# EAGLE design Valve_master (EAGLE 8.2.2)
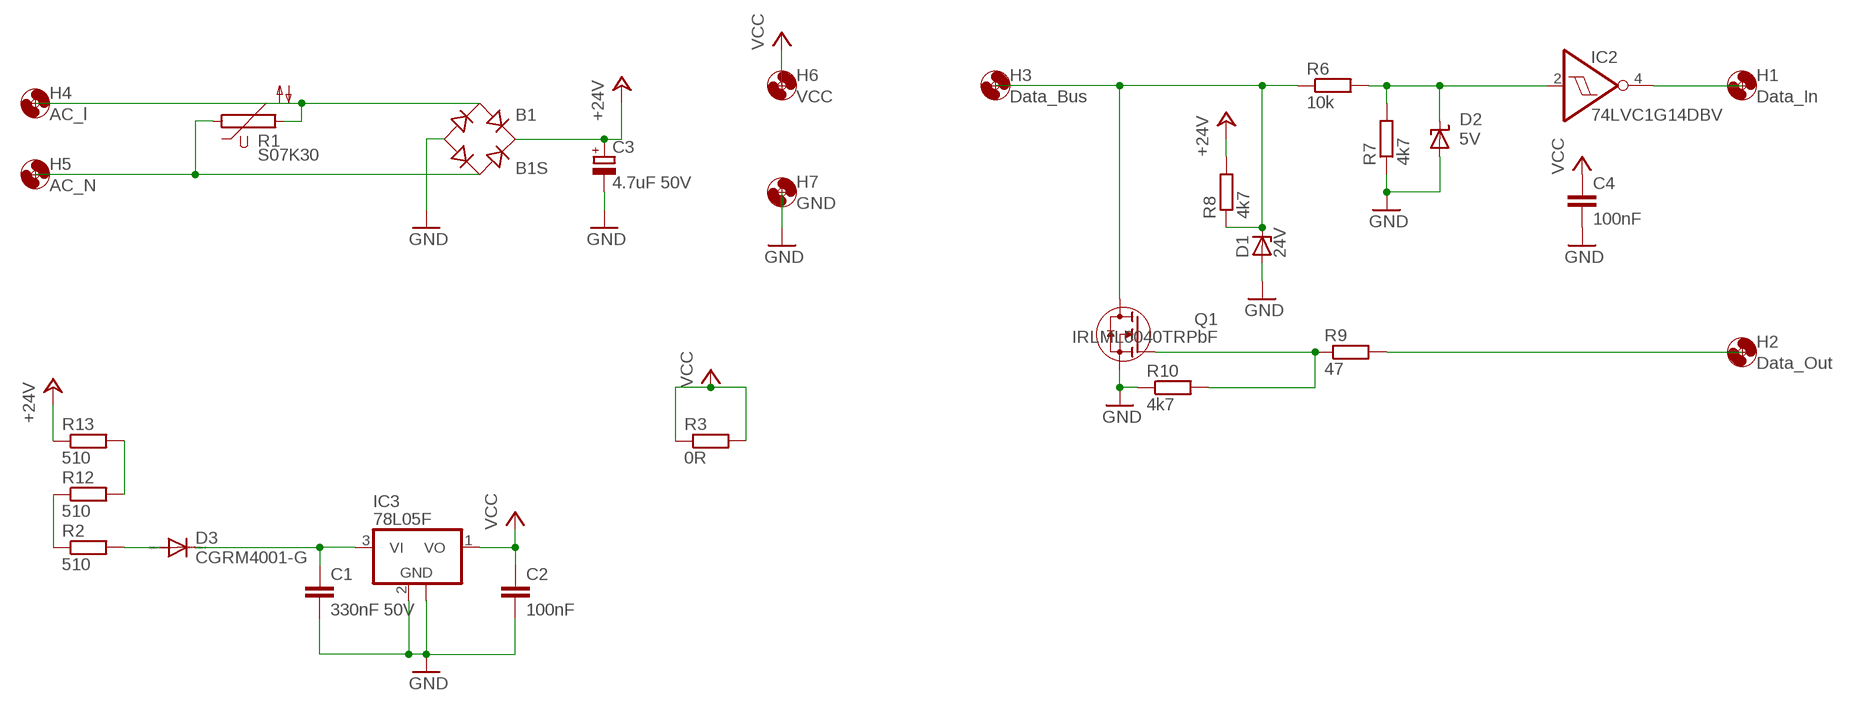
[diagram p0: schematic, sheet 1]

## Parts
B1  B1S  [MBS]
C1  330nF 50V  C-EUC0805K  [C0805K]
C2  100nF  C-EUC0805K  [C0805K]
C3  4.7uF 50V  CPOL-EUD/7343-31R  [D/7343-31R]
C4  100nF  C0805  [0805]
D1  24V  ZENER-DIODESOT23  [SOT23]
D2  5V  ZENER  [SOD123]
D3  CGRM4001-G  [SOD-123_MINI-SMA]
H1  Data_In  MOUNT-HOLE3.2  [3,2]
H2  Data_Out  MOUNT-HOLE3.2  [3,2]
H3  Data_Bus  MOUNT-HOLE3.2  [3,2]
H4  AC_l  MOUNT-HOLE3.2  [3,2]
H5  AC_N  MOUNT-HOLE3.2  [3,2]
H6  VCC  MOUNT-HOLE3.2  [3,2]
H7  GND  MOUNT-HOLE3.2  [3,2]
IC2  74LVC1G14DBV  [SOT23-5]
IC3  78L05F  [SOT89]
Q1  IRLML0040TRPbF  SI2302  [SOT-23-GSD]
R1  S07K30  S07K40  [S07K40]
R2  510  R-EU_R2512  [R2512]
R3  0R  R0805  [0805R]
R6  10k  R-EU_R0805  [R0805]
R7  4k7  R-EU_R0805  [R0805]
R8  4k7  R-EU_R0805  [R0805]
R9  47  R-EU_R0805  [R0805]
R10  4k7  R-EU_R0805  [R0805]
R12  510  R-EU_R2512  [R2512]
R13  510  R-EU_R2512  [R2512]

## Nets
+24V: B1.+ C3.+ R8.2 R13.1
AC_L: B1.AC1 H4.P$1 R1.2
AC_N: B1.AC2 H5.P$1 R1.1
DATA_BUS: D1.3(C) H3.P$1 Q1.D R6.1 R8.1
DATA_IN: H1.P$1 IC2.4(O)
DATA_OUT: H2.P$1 R9.2
GND: B1.- C1.2 C2.2 C3.- C4.2 D1.1(A) D2.A H7.P$1 IC3.2(GND) IC3.2@1(GND) Q1.S R7.1 R10.1
N$1: C1.1 D3.C IC3.3(VI)
N$2: D3.A R2.2
N$3: R12.2 R13.2
N$5: R2.1 R12.1
N$6: D2.C IC2.2(I) R6.2 R7.2
N$7: Q1.G R9.1 R10.2
VCC: C2.1 C4.1 H6.P$1 IC3.1(VO) R3.1 R3.2

## Power pins joined to a net without a drawn wire
GND: IC2.3(GND)
VCC: IC2.5(VCC)

## Library data of the parts
B1 = rectifier:B*S: Surface Mount Glass Passivated Bridge Rectifiers Source: Comchip Bridge Rectifiers B05S-G_B10S-G.pdf
C1 C2 = rcl:C-EU: CAPACITOR, European symbol
C3 = rcl:CPOL-EU: POLARIZED CAPACITOR, European symbol
C4 = usb:C0805
D1 = diode:ZENER-DIODE: Z-Diode
D2 = usb:ZENER
D3 = diode:CGRM400*-G: Molded plasitc,JEDEC SOD-123/Mini SMA Source: Comchip CGRM4001-G.pdf
H1-H7 = holes:MOUNT-HOLE: MOUNTING HOLE with drill center marker
IC2 = 74xx-little-de:74*1G14: Single Schmitt-Trigger Inverter Gate
IC3 = linear:78L*: POSITOIV-VOLTAGE REGULATORS Output up to 100 mA Source: Datasheet <http://focus.ti.com/lit/ds/symlink/ua78l05.pdf>
Q1 = usb:SI2302: N-канальный полевик
R1 = varistor:S07K40: VARISTOR
R2 R6-R10 R12 R13 = rcl:R-EU_: RESISTOR, European symbol
R3 = usb:R0805

## Board
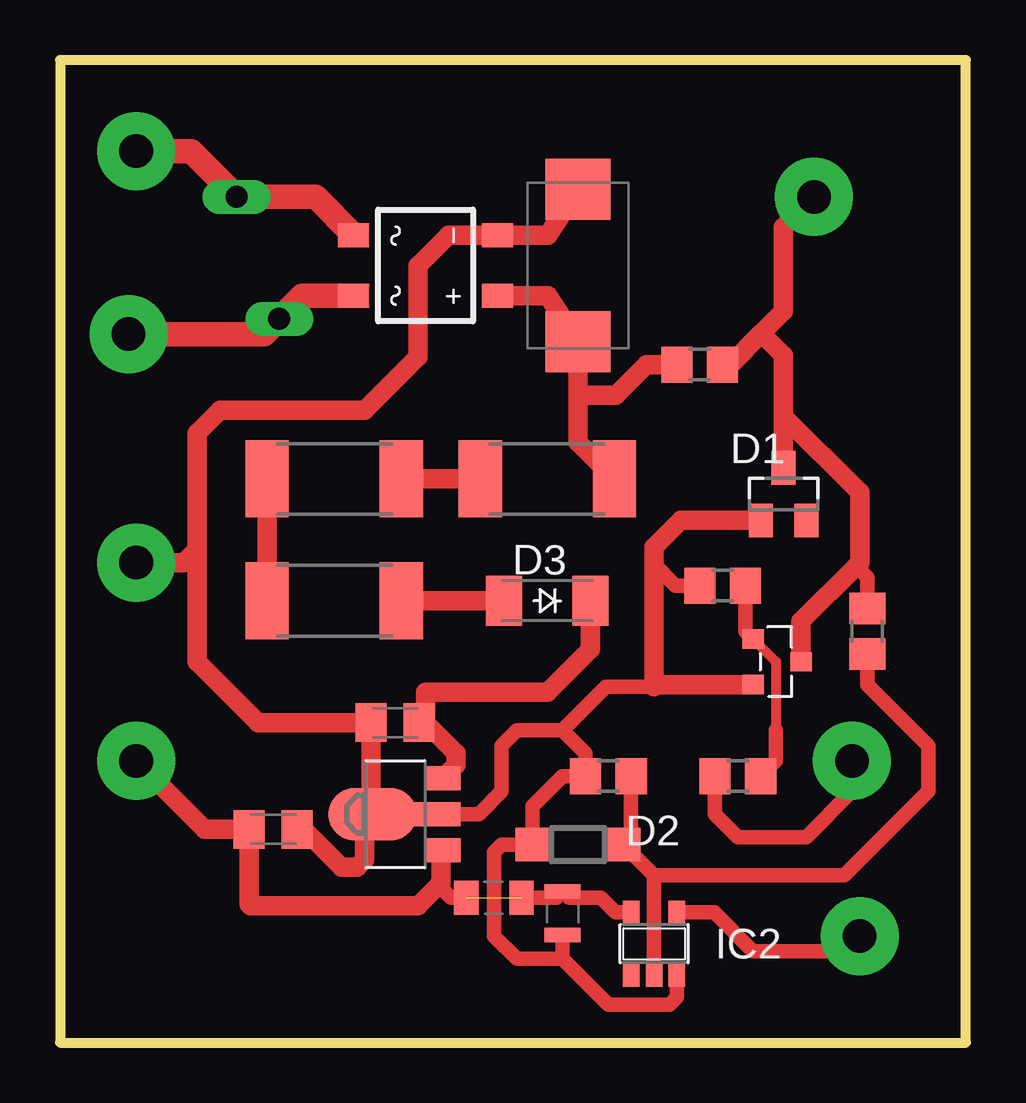
[diagram p1: board, top side]
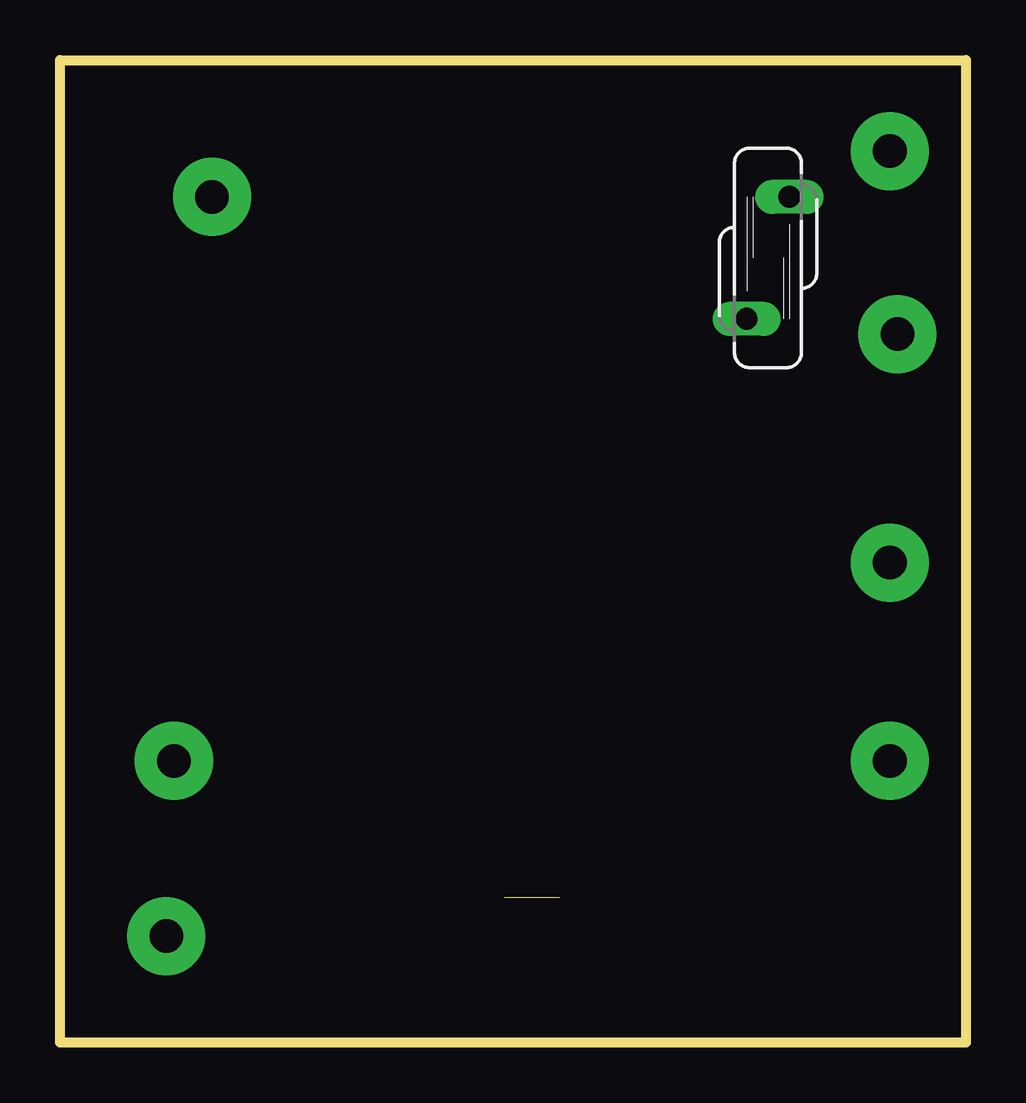
[diagram p2: board, bottom side, seen from below]

Size 37.77 x 40.95 mm. Coordinates in mm from the lower left corner, seen from the top.
Outline: 0,0 37.77,0 37.77,40.95 0,40.95 0,0
Copper layers (1*16): Top 0.035mm / dielectric 1.5mm / Bottom 0.035mm
Design rules "My": minimum track width 16mil, minimum drill 0.35mm, track to track 12mil, track to pad 12mil, pad to pad 12mil, via to via 12mil, smd to smd 12mil, copper to edge 40mil, drill to drill 24mil, minimum pad ring 10mil, minimum via ring 8mil, stop-mask expansion 4mil, vias tented up to drill 0mil, thermal gap 10mil

### Footprints (pad centres in the part's own frame; a part is rotated, then mirrored left to right if it is on the bottom)
MBS = smd 1 x 1.3: + -1.27,-3; - 1.27,-3; AC1 -1.27,3; AC2 1.27,3
C0805K = smd 1.3 x 1.6: 1 -1,0; 2 1,0
D/7343-31R = smd 2.55 x 2.7: + 3.175,0; - -3.175,0
0805 = smd 0.6 x 1.5: 1 -0.9,0; 2 0.9,0
SOT23 = smd 1 x 1.4: 1 -0.95,-1.1; 2 0.95,-1.1; 3 0,1.1
SOD123 = smd 1.4 x 1.4: A 1.9,0; C -1.9,0
SOD-123_MINI-SMA = smd 1.5 x 2.1: A 1.8,0; C -1.8,0
3,2 = drill 1.4 pad 3.251: P$1 0,0
SOT23-5 = smd 0.69 x 0.99: 1 -0.95,-1.29; 2 0,-1.29; 3 0.95,-1.29; 4 0.95,1.3; 5 -0.95,1.3
SOT89 = smd 1 x 1.5: 1 -1.499,-1.981; 3 1.499,-1.981 | smd 1 x 2: 2 0,-1.727 | smd 2.2 x 3.7: 2@1 0,0.94
SOT-23-GSD = smd 0.8 x 0.9: D 0,2; G -0.95,0; S 0.95,0
S07K40 = drill 0.914 long: 1 -0.889,-2.54; 2 0.889,2.54
R2512 = smd 1.8 x 3.2: 1 -2.8,0; 2 2.8,0
0805R = smd 1.016 x 1.422: 1 -1.16,0.01; 2 1.14,0.01
R0805 = smd 1.3 x 1.5: 1 -0.95,0; 2 0.95,0

### Placement (x,y rotation side)
B1  15.24,32.38 90 top
C1  13.97,13.34 180 top
C2  8.89,8.89 0 top
C3  21.59,32.38 270 top
C4  20.95,5.4 270 top
D1  30.16,22.86 0 top
D2  21.59,8.26 180 top
D3  20.32,18.41 180 top
H1  33.34,4.45 0 top
H2  33.02,11.75 0 top
H3  31.43,35.24 0 top
H4  2.86,29.53 0 top
H5  3.17,37.15 0 top
H6  3.17,11.75 0 top
H7  3.17,20 0 top
IC2  24.77,4.13 0 top
IC3  13.97,9.53 90 top
Q1  28.89,15.88 270 top
R1  8.26,32.7 180 bottom
R2  11.43,18.41 0 top
R3  18.1,6.03 0 top
R6  33.66,17.14 270 top
R7  22.86,11.11 0 top
R8  26.67,28.26 180 top
R9  28.26,11.11 180 top
R10  27.62,19.05 0 top
R12  11.43,23.5 0 top
R13  20.32,23.5 180 top

### Tracks (layer width: path | path; a pad name or v marks a point on that pad's centre or on a via)
+24V
  Top 0.813: B1.+ 20.34,31.11 C3.+ 21.59,26.69 | 21.59,26.69 21.59,25.02 R13.1 | R8.2 24.45,28.26 23.18,26.99 21.89,26.99 21.59,26.69
AC_L
  Top 1.016: B1.AC1 10.1,31.11 R1.2 8.51,29.53 H4.P$1
AC_N
  Top 1.016: H5.P$1 5.46,37.15 R1.1 10.65,35.24 B1.AC2
DATA_BUS
  Top 0.61: R6.1 33.66,19.4 33.19,19.86
  Top 0.813: R8.1 27.94,28.26 29.24,29.56 | 29.24,29.56 30.16,30.48 30.16,33.97 H3.P$1 | 30.16,26.11 D1.3 | 30.16,26.11 30.16,28.64 29.24,29.56 | Q1.D 30.89,17.56 33.19,19.86 33.34,20 33.34,22.94 30.16,26.11
DATA_IN
  Top 0.61: IC2.4 27.27,5.43 28.89,3.81 32.7,3.81 H1.P$1
DATA_OUT
  Top 0.61: H2.P$1 33.02,10.48 31.11,8.57 28.26,8.57 27.3,9.53 R9.2
GND
  Top 0.61: R10.1 25.66,19.05 24.77,19.95 | 20.95,13.02 22.77,14.83 24.77,14.83 24.86,14.93 | 20.95,13.02 19.05,13.02 18.41,12.38 18.41,10.48 17.46,9.53 IC3.2 | 20.95,13.02 21.91,12.06 R7.1 20.95,11.11 19.69,9.85 D2.A 18.41,8.26 18.1,7.94 18.1,4.45 19.05,3.49 20.95,3.49 | IC2.3 25.71,1.9 25.4,1.59 22.86,1.59 20.95,3.49 | 20.95,3.49 C4.2
  Top 0.813: C3.- 20.34,33.66 B1.- 16.19,33.66 14.92,32.38 14.92,28.57 12.7,26.35 6.67,26.35 5.71,25.4 5.71,20.56 | 5.71,20.56 5.71,15.88 8.26,13.34 C1.2 12.97,9.59 | H7.P$1 5.16,20 5.71,20.56 | 12.97,9.59 IC3.2@1 | C2.2 10.16,8.89 11.75,7.3 12.38,7.3 12.7,7.62 12.7,9.31 12.91,9.53 | 12.91,9.53 12.97,9.59 | IC3.2 12.91,9.53 | D1.1 25.89,21.76 24.77,20.64 24.77,19.95 24.77,14.83 | 24.86,14.93 Q1.S
N$1
  Top 0.813: D3.C 22.12,16.41 20.32,14.61 15.24,14.61 15.24,13.61 C1.1 15.24,13.34 16.51,12.06 16.51,11.58 IC3.3
N$2
  Top 0.813: R2.2 D3.A
N$3
  Top 0.813: R13.2 R12.2
N$5
  Top 0.813: R12.1 R2.1
N$6
  Top 0.61: R6.2 33.66,14.92 36.2,12.38 36.2,10.48 32.7,6.99 24.8,6.99 | R7.2 23.81,8.57 D2.C 24.76,6.99 24.8,6.99 | IC2.2 24.77,6.96 24.8,6.99
N$7
  Top 0.406: Q1.G 29.84,15.88 29.84,13.02
  Top 0.61: R10.2 28.57,17.14 Q1.G | 29.84,13.02 29.84,11.75 R9.1
VCC  (1 unrouted)
  Top 0.61: IC2.5 23.15,5.43 22.54,6.03 21.22,6.03 C4.1 20.7,6.04 R3.2 | R3.1 16.31,6.04 15.78,6.57
  Top 0.813: IC3.1 15.88,7.95 15.88,6.67 15.78,6.57 14.92,5.71 7.94,5.71 7.89,5.76 C2.1 6.03,8.89 H6.P$1